# EAGLE design 328-programmer (EAGLE 7.2.0)
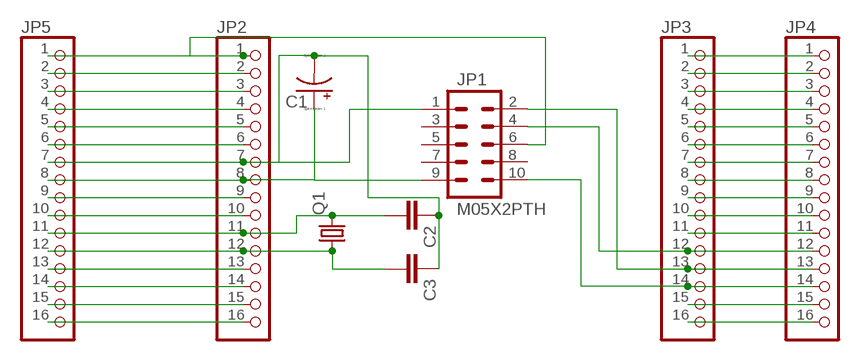
[diagram p0: schematic, sheet 1]

## Parts
C1  CPOL-USE2.5-7  [E2,5-7]
C2  CAPPTH2  [CAP-PTH-SMALL2]
C3  CAPPTH2  [CAP-PTH-SMALL2]
JP1  M05X2PTH  [AVR_ICSP]
JP2  PINHD-1X16  [1X16]
JP3  PINHD-1X16  [1X16]
JP4  PINHD-1X16  [1X16]
JP5  PINHD-1X16  [1X16]
Q1  CRYSTALHC49S  [HC49/S]

## Nets
CR1: C3.2 JP2.12 JP5.12 Q1.1
CR2: C2.2 JP2.11 JP5.11 Q1.2
GND: C1.- C2.1 C3.1 JP1.1 JP2.7 JP5.7
N$1: JP3.16 JP4.16
N$2: JP3.15 JP4.15
N$3: JP3.11 JP4.11
N$4: JP3.10 JP4.10
N$5: JP3.9 JP4.9
N$6: JP3.8 JP4.8
N$7: JP3.7 JP4.7
N$8: JP3.6 JP4.6
N$9: JP3.5 JP4.5
N$10: JP3.4 JP4.4
N$11: JP3.3 JP4.3
N$12: JP3.2 JP4.2
N$13: JP3.1 JP4.1
N$14: JP2.16 JP5.16
N$15: JP2.15 JP5.15
N$16: JP2.14 JP5.14
N$17: JP2.13 JP5.13
N$18: JP2.10 JP5.10
N$19: JP2.9 JP5.9
N$20: JP2.6 JP5.6
N$21: JP2.5 JP5.5
N$22: JP2.4 JP5.4
N$23: JP2.3 JP5.3
N$24: JP2.2 JP5.2
RST: JP1.6 JP2.1 JP5.1
SCK: JP1.4 JP3.12 JP4.12
SI: JP1.10 JP3.14 JP4.14
SO: JP1.2 JP3.13 JP4.13
VCC: C1.+ JP1.9 JP2.8 JP5.8
Unconnected: JP1.3 JP1.5 JP1.7 JP1.8

## Library data of the parts
C1 = resistor:CPOL-US: POLARIZED CAPACITOR, American symbol
C2 C3 = SparkFun-Passives:CAP: Capacitor Standard 0603 ceramic capacitor, and 0.1" leaded capacitor.
JP1 = SparkFun-Connectors:M05X2: Header 5x2 Standard 10-pin dual row 0.1" header. Commonly used with AVR-ISP. Use with Spark Fun Electronics SKU: PRT-00778
JP2-JP5 = pinhead:PINHD-1X16: PIN HEADER
Q1 = crystal:CRYSTAL: CRYSTAL; OC_FARNELL: 1667008; OC_NEWARK: unknown

## Board
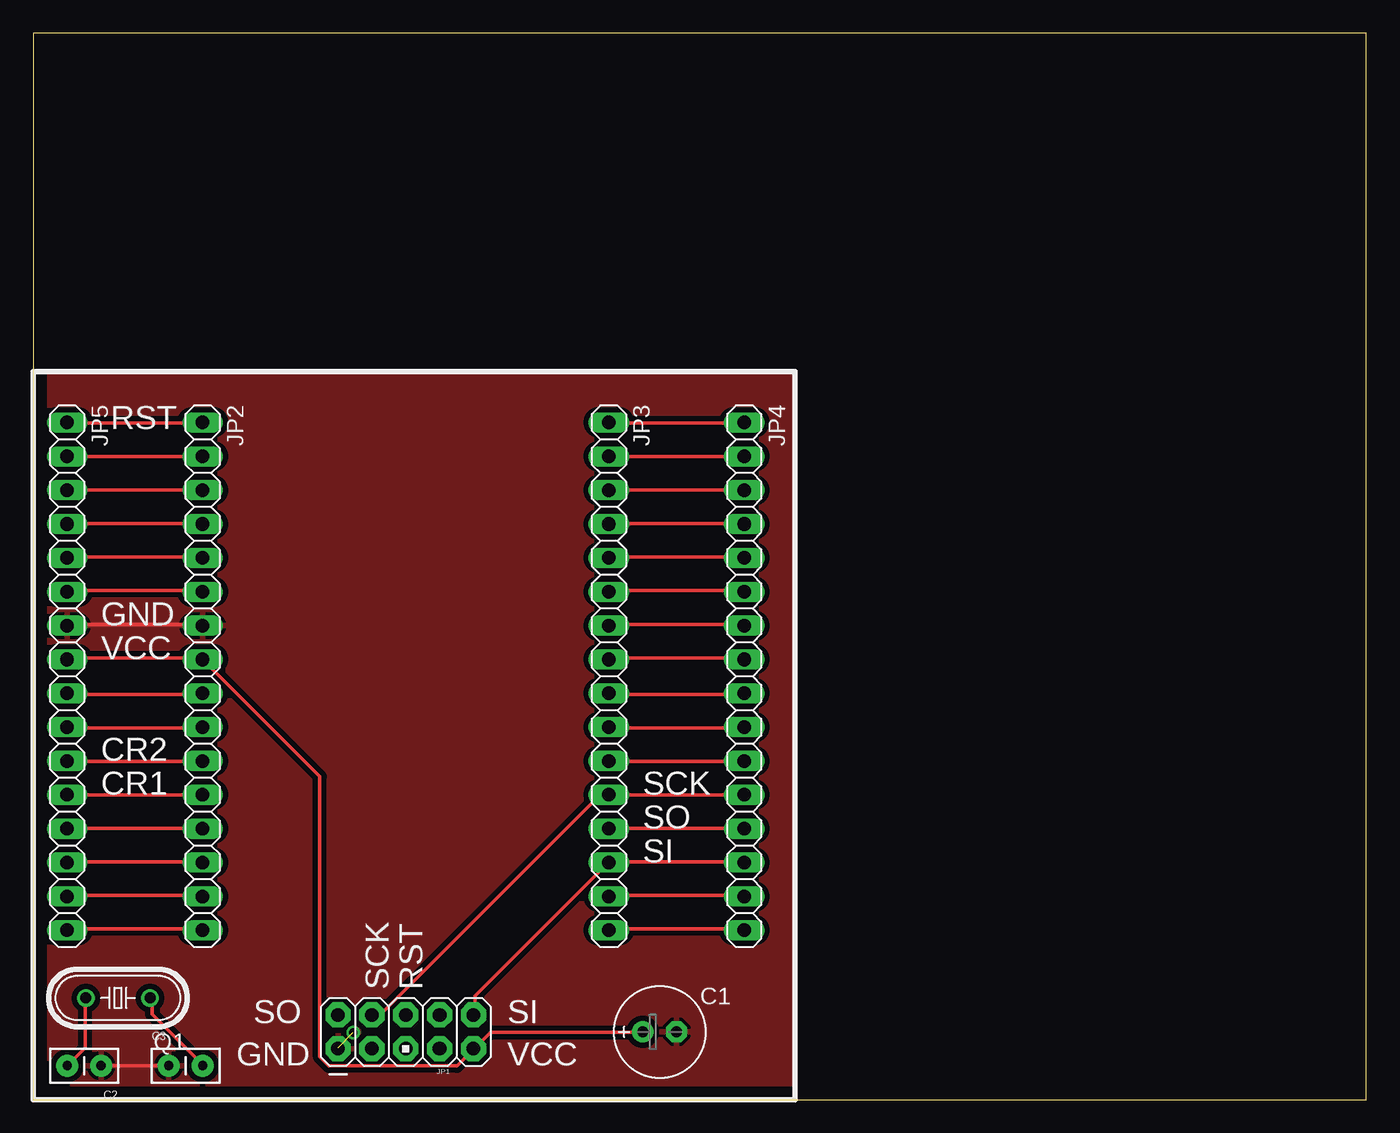
[diagram p1: board, top side]
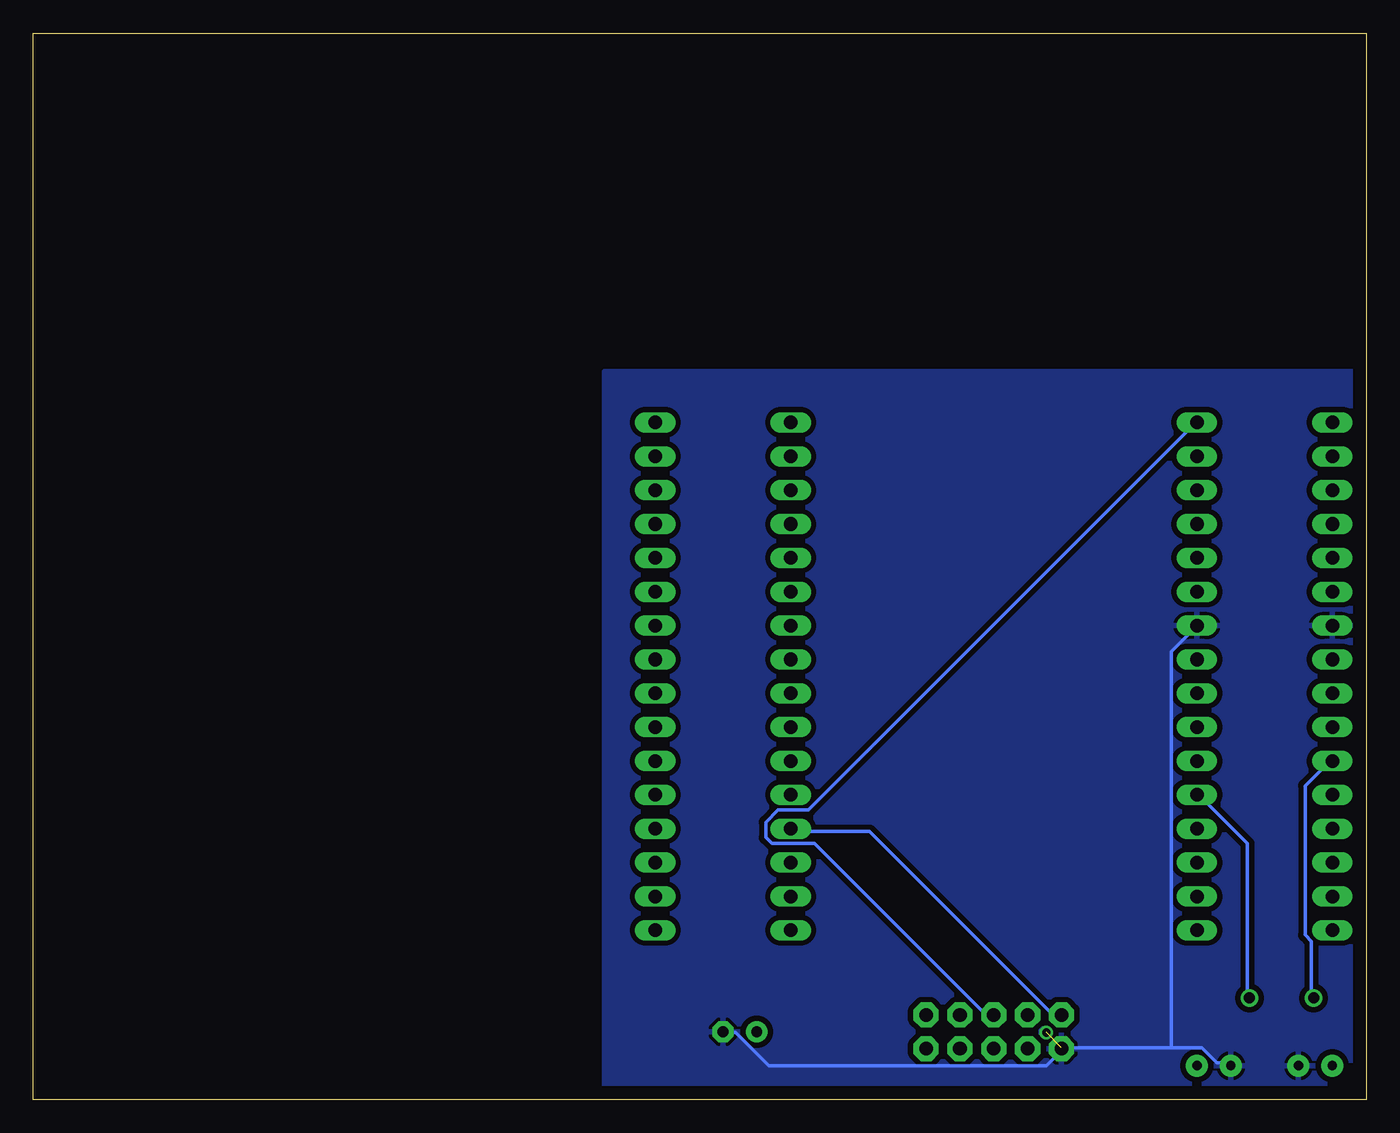
[diagram p2: board, bottom side, seen from below]

Size 100 x 80 mm. Coordinates in mm from the lower left corner, seen from the top.
Outline: 0,0 100,0 100,80 0,80 0,0
Copper layers (1*16): Top 0.035mm / dielectric 1.5mm / Bottom 0.035mm
Design rules "default": minimum track width 10mil, minimum drill 24mil, track to track 8mil, track to pad 8mil, pad to pad 8mil, via to via 8mil, smd to smd 8mil, copper to edge 40mil, drill to drill 8mil, minimum pad ring 10mil, minimum via ring 8mil, stop-mask expansion 4mil, vias tented up to drill 0mil, thermal gap 10mil

### Footprints (pad centres in the part's own frame; a part is rotated, then mirrored left to right if it is on the bottom)
E2,5-7 = drill 0.813 pad 1.6: + -1.27,0 | drill 0.813 pad 1.6 octagon: - 1.27,0
CAP-PTH-SMALL2 = drill 0.7 pad 1.651: 1 0,0; 2 2.54,0
AVR_ICSP = drill 1.016 pad 1.88 octagon: 1 -1.27,5.08; 2 1.27,5.08; 3 -1.27,2.54; 4 1.27,2.54; 5 -1.27,0; 6 1.27,0; 7 -1.27,-2.54; 8 1.27,-2.54; 9 -1.27,-5.08; 10 1.27,-5.08
1X16 = drill 1.016 long: 1 -19.05,0; 2 -16.51,0; 3 -13.97,0; 4 -11.43,0; 5 -8.89,0; 6 -6.35,0; 7 -3.81,0; 8 -1.27,0; 9 1.27,0; 10 3.81,0; 11 6.35,0; 12 8.89,0; 13 11.43,0; 14 13.97,0; 15 16.51,0; 16 19.05,0
HC49/S = drill 0.813: 1 -2.413,0; 2 2.413,0

### Placement (x,y rotation side)
C1  46.99,5.08 0 top
C2  5.08,2.54 180 top
C3  10.16,2.54 0 top
JP1  27.94,5.08 90 top
JP2  12.7,31.75 270 top
JP3  43.18,31.75 270 top
JP4  53.34,31.75 270 top
JP5  2.54,31.75 270 top
Q1  6.35,7.62 180 top

### Tracks (layer width: path | path; a pad name or v marks a point on that pad's centre or on a via)
CR1
  Top 0.254: Q1.1 8.91,7.54 8.91,6.4 12.57,2.74 C3.2 | JP2.12 JP5.12
  Bottom 0.254: Q1.1 8.91,7.77 8.91,19.2 12.57,22.86 JP2.12
CR2
  Top 0.254: C2.2 3.89,3.89 3.89,7.54 Q1.2 | JP5.11 2.74,25.38 12.57,25.38 JP2.11
  Bottom 0.254: Q1.2 4.12,7.77 4.12,11.89 4.57,12.34 4.57,23.55 2.74,25.38 JP5.11
GND  (via drill 0.61)  (1 unrouted)
  Top 0.254: JP5.7 2.74,35.66 12.57,35.66 JP2.7 | C2.1 5.26,2.52 10.06,2.52 C3.1
  Bottom 0.254: C1.- 48.23,5.03 47.32,5.03 44.81,2.52 24,2.52 22.86,3.66 JP1.1 22.86,3.89 14.63,3.89 | 14.63,3.89 12.34,3.89 11.2,2.74 10.29,2.74 C3.1 | 14.63,3.89 14.63,33.6 12.8,35.43 JP2.7
  other vias: 24,5.03
  pour Bottom (isolate 0.406): 0,54.61 57.15,54.61 57.15,0 0,0
  pour Top (isolate 0.406): 0,54.61 57.15,54.61 57.15,0 0,0
N$1
  Top 0.254: JP3.16 43.2,12.8 53.26,12.8 JP4.16
N$2
  Top 0.254: JP3.15 43.2,15.32 53.26,15.32 JP4.15
N$3
  Top 0.254: JP3.11 43.2,25.38 53.26,25.38 JP4.11
N$4
  Top 0.254: JP3.10 43.2,27.89 53.26,27.89 JP4.10
N$5
  Top 0.254: JP3.9 43.2,30.4 53.26,30.4 JP4.9
N$6
  Top 0.254: JP3.8 43.2,33.15 53.26,33.15 JP4.8
N$7
  Top 0.254: JP3.7 43.2,35.66 53.26,35.66 JP4.7
N$8
  Top 0.254: JP3.6 43.2,38.18 53.26,38.18 JP4.6
N$9
  Top 0.254: JP3.5 43.2,40.69 53.26,40.69 JP4.5
N$10
  Top 0.254: JP3.4 43.2,43.2 53.26,43.2 JP4.4
N$11
  Top 0.254: JP4.3 JP3.3
N$12
  Top 0.254: JP3.2 43.2,48.23 53.26,48.23 JP4.2
N$13
  Top 0.254: JP3.1 43.2,50.75 53.26,50.75 JP4.1
N$14
  Top 0.254: JP5.16 2.74,12.8 12.57,12.8 JP2.16
N$15
  Top 0.254: JP5.15 2.74,15.32 12.57,15.32 JP2.15
N$16
  Top 0.254: JP5.14 2.74,17.83 12.57,17.83 JP2.14
N$17
  Top 0.254: JP5.13 2.74,20.34 12.57,20.34 JP2.13
N$18
  Top 0.254: JP5.10 2.74,27.89 12.57,27.89 JP2.10
N$19
  Top 0.254: JP5.9 2.74,30.4 12.57,30.4 JP2.9
N$20
  Top 0.254: JP5.6 2.74,38.18 12.57,38.18 JP2.6
N$21
  Top 0.254: JP5.5 2.74,40.69 12.57,40.69 JP2.5
N$22
  Top 0.254: JP5.4 2.74,43.2 12.57,43.2 JP2.4
N$23
  Top 0.254: JP2.3 JP5.3
N$24
  Top 0.254: JP5.2 2.74,48.23 12.57,48.23 JP2.2
RST
  Top 0.254: JP5.1 2.74,50.75 12.57,50.75 JP2.1
  Bottom 0.254: JP1.6 28.12,6.4 28.57,6.4 41.38,19.2 44.58,19.2 45.03,19.66 45.03,20.8 44.12,21.72 41.83,21.72 12.8,50.75 JP2.1
SCK
  Top 0.254: JP4.12 JP3.12 42.52,22.86 26.06,6.4 25.6,6.4 JP1.4
SI
  Top 0.254: JP4.14 53.26,17.83 43.2,17.83 JP3.14 42.98,17.6 33.15,7.77 33.15,6.4 JP1.10
SO
  Top 0.254: JP3.13 43.2,20.34 53.26,20.34 JP4.13
  Bottom 0.254: JP1.2 22.86,6.4 23.55,6.4 37.26,20.12 42.98,20.12 JP3.13
VCC
  Top 0.254: JP5.8 2.74,33.15 12.57,33.15 JP2.8 21.49,24.23 21.49,3.2 22.17,2.52 31.77,2.52 32.92,3.66 JP1.9 33.15,3.89 34.29,5.03 45.72,5.03 C1.+

### Text on the board
_tsilk: RST | GND | VCC | CR2 | CR1 | SCK | SO | SI | SCK | RST | SO | SI | GND | VCC